# EAGLE design Canzasi-Wrtr (EAGLE 7.6.0)
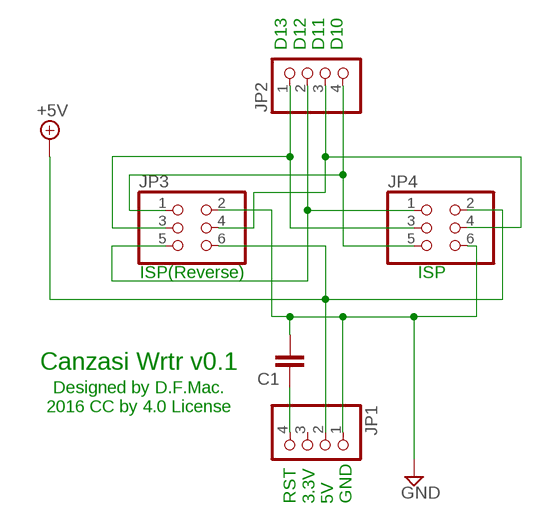
[diagram p0: schematic, sheet 1]

## Parts
C1  C-EUC0805  [C0805]
JP1  PINHD-1X4  [1X04]
JP2  PINHD-1X4  [1X04]
JP3  PINHD-2X3  [2X03]
JP4  PINHD-2X3  [2X03]

## Nets
+5V: JP1.2 JP3.6 JP4.2
GND: C1.2 JP1.1 JP3.2 JP4.6
N$1: JP2.4 JP3.1 JP4.5
N$2 [GND]: C1.1 JP1.4
N$4: JP2.1 JP3.3 JP4.3
N$5: JP2.2 JP3.5 JP4.1
N$6: JP2.3 JP3.4 JP4.4
Unconnected: JP1.3

## Notes on the sheet
- D13
  D12
  D11
  D10
- ISP(Reverse) | ISP
- Canzasi Wrtr v0.1
- Designed by D.F.Mac.
  2016 CC by 4.0 License
- RST
  3.3V
  5V
  GND

## Library data of the parts
C1 = 0my:C-EU: CAPACITOR, European symbol
JP1 JP2 = 0my:PINHD-1X4: PIN HEADER
JP3 JP4 = 0my:PINHD-2X3: PIN HEADER

## Net classes
0 default: width 0.33 mm, drill 0.178 mm, clearance 0.152 mm
1 VCC: width 0.508 mm, drill 0.178 mm, clearance 0.152 mm
2 GND: width 0.508 mm, drill 0.178 mm, clearance 0.152 mm

## Board
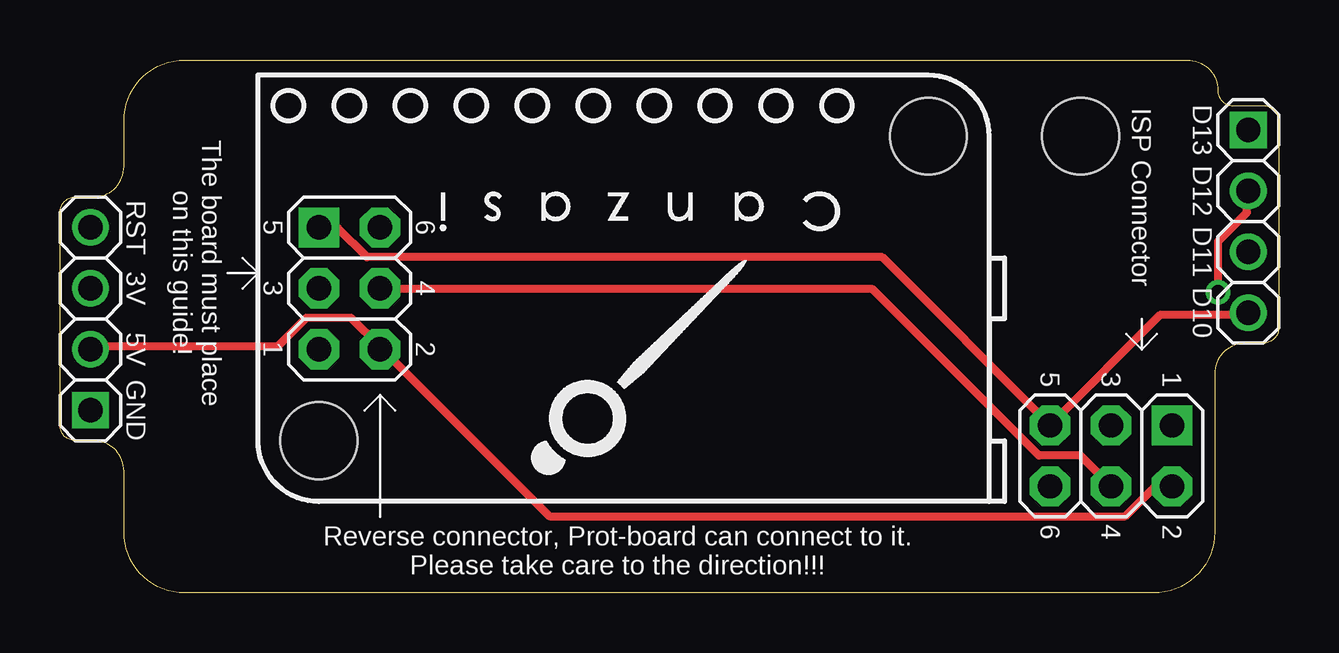
[diagram p1: board, top side]
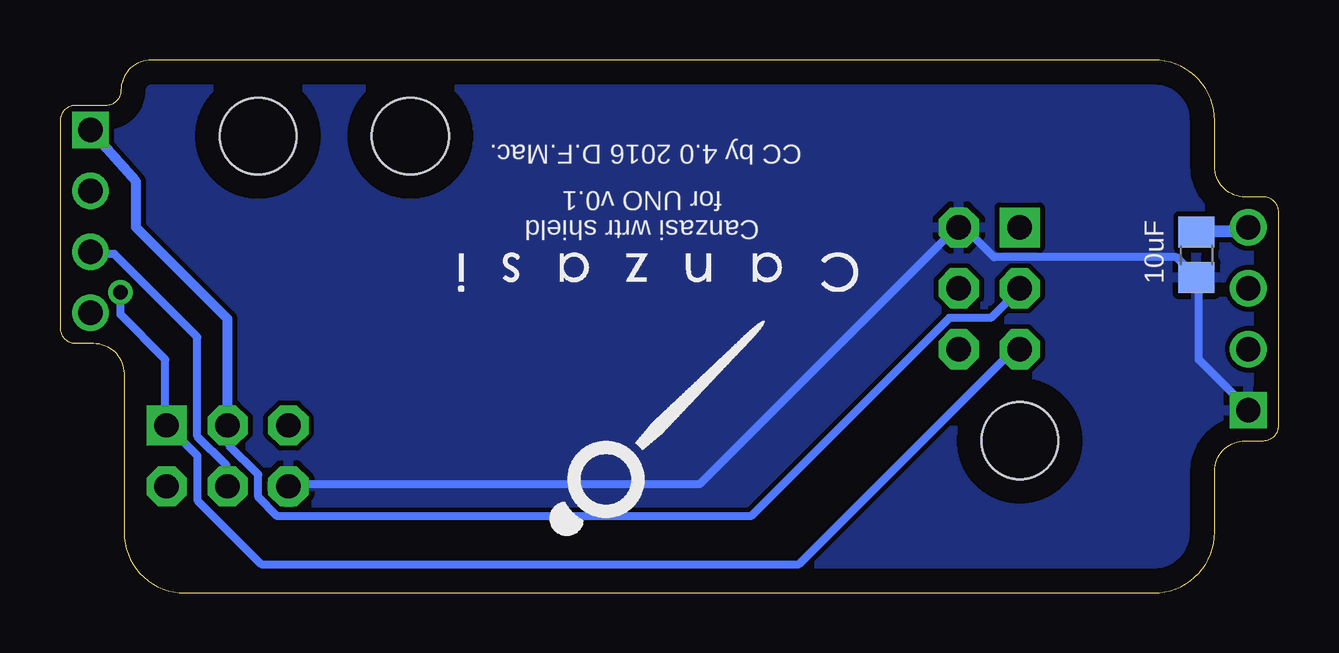
[diagram p2: board, bottom side, seen from below]

Size 50.8 x 22.23 mm. Coordinates in mm from the lower left corner, seen from the top.
Outline: 5.21,22.23 46.99,22.23 arc-90 48.26,20.95 arc90 48.9,20.32 50.16,20.32 arc-90 50.8,19.68 50.8,11.05 arc-90 50.16,10.41 49.4,10.41 arc90 48.13,9.14 48.13,2.54 arc-90 45.59,0 5.21,0 arc-90 2.67,2.54 2.67,5.08 arc90 1.4,6.35 0.64,6.35 arc-90 0,6.99 0,15.88 arc-90 0.64,16.51 1.4,16.51 arc90 2.67,17.78 2.67,19.68 arc-90 5.21,22.23
Copper layers (1*16): Top 0.035mm / dielectric 1.5mm / Bottom 0.035mm
Design rules "default": minimum track width 10mil, minimum drill 24mil, track to track 8mil, track to pad 8mil, pad to pad 8mil, via to via 8mil, smd to smd 8mil, copper to edge 40mil, drill to drill 8mil, minimum pad ring 10mil, minimum via ring 8mil, stop-mask expansion 4mil, vias tented up to drill 0mil, thermal gap 10mil
Holes 3.2 mm at 42.55,19.05 36.2,19.05 10.79,6.35

### Footprints (pad centres in the part's own frame; a part is rotated, then mirrored left to right if it is on the bottom)
C0805 = smd 1.3 x 1.5: 1 -0.95,0; 2 0.95,0
1X04 = drill 1.016 square: 1 -3.81,0 | drill 1.016: 2 -1.27,0; 3 1.27,0; 4 3.81,0
2X03 = drill 1.016 pad 1.676 square: 1 -2.54,-1.27 | drill 1.016 pad 1.676 octagon: 2 -2.54,1.27; 3 0,-1.27; 4 0,1.27; 5 2.54,-1.27; 6 2.54,1.27

### Placement (x,y rotation side)
C1  3.43,14.1 270 bottom
JP1  1.27,11.43 90 top
JP2  49.53,15.49 270 top
JP3  12.06,12.7 270 top
JP4  43.81,5.71 180 top
U$1  CANZASI-LOGOMEDIUM  [CANZASI-LOGO-MEDIUM]  16.76,14.99 180 bottom
U$2  CANZASI-LOGOMEDIUM  [CANZASI-LOGO-MEDIUM]  33.27,17.53 180 top

### Tracks (layer width: path | path; a pad name or v marks a point on that pad's centre or on a via)
+5V
  Top 0.33: JP1.2 1.33,10.27 9.07,10.27 10.27,11.47 12.13,11.47 13.34,10.27 JP3.6 13.47,10.13 20.4,3.2 44.41,3.2 45.61,4.4 46.27,4.4 JP4.2
GND
  Bottom 0.33: JP1.1 1.33,7.73 3.33,9.73 3.33,13.07 C1.2 3.47,13.2 4.27,14 11.87,14 13.07,15.2 13.34,15.2 JP3.2 13.47,15.2 24.14,4.53 41.2,4.53 JP4.6
  pour Bottom: 0.64,22.23 50.16,22.23 50.16,0 0.64,0
N$1
  Top 0.33: JP2.4 49.47,11.6 45.87,11.6 41.34,7.07 JP4.5 41.2,7.07 34.27,14 12.8,14 11.6,15.2 10.8,15.2 JP3.1
N$2
  Bottom 0.508: C1.1 3.33,15.07 1.47,15.07 1.33,15.2 JP1.4
N$4
  Bottom 0.33: JP4.3 43.74,6.93 43.74,6.13 42.54,4.93 42.54,4 41.74,3.2 22,3.2 13.73,11.47 12,11.47 10.8,12.67 JP3.3
  Bottom 0.406: JP4.3 43.81,11.43 47.62,15.24 47.62,17.14 JP2.1
N$5  (via drill 0.61)
  Top 0.33: v48.27,12.54 48.27,14.67 49.47,15.87 49.47,16.67 JP2.2
  Bottom 0.33: v48.27,12.54 48.27,11.6 46.41,9.73 46.41,7.07 JP4.1 46.27,6.93 45.07,5.73 45.07,3.87 42.41,1.2 20,1.2 11.07,10.13 10.8,10.13 JP3.5
N$6
  Top 0.33: JP3.4 13.34,12.67 33.87,12.67 40.8,5.73 42.54,5.73 43.74,4.53 JP4.4
  Bottom 0.33: JP2.3 49.47,14.13 48.54,14.13 45.07,10.67 45.07,6.53 43.87,5.33 43.87,4.53 JP4.4

### Text on the board
tNames: D13 | ISP Connector | D12 | RST | 5 | 6 | D11 | 3V | The board must place / on this guide! | 3 | 4 | D10 | 5V | 1 | 2 | 5 | 3 | 1 | GND | 6 | 4 | 2 | Reverse connector, Prot-board can connect to it. / Please take care to the direction!!!
bNames: CC by 4.0 2016 D.F.Mac. | Canzasi wrtr shield / for UNO v0.1 | 10uF